# Altium schematic sheet adg731-switches.SchDoc
size A4
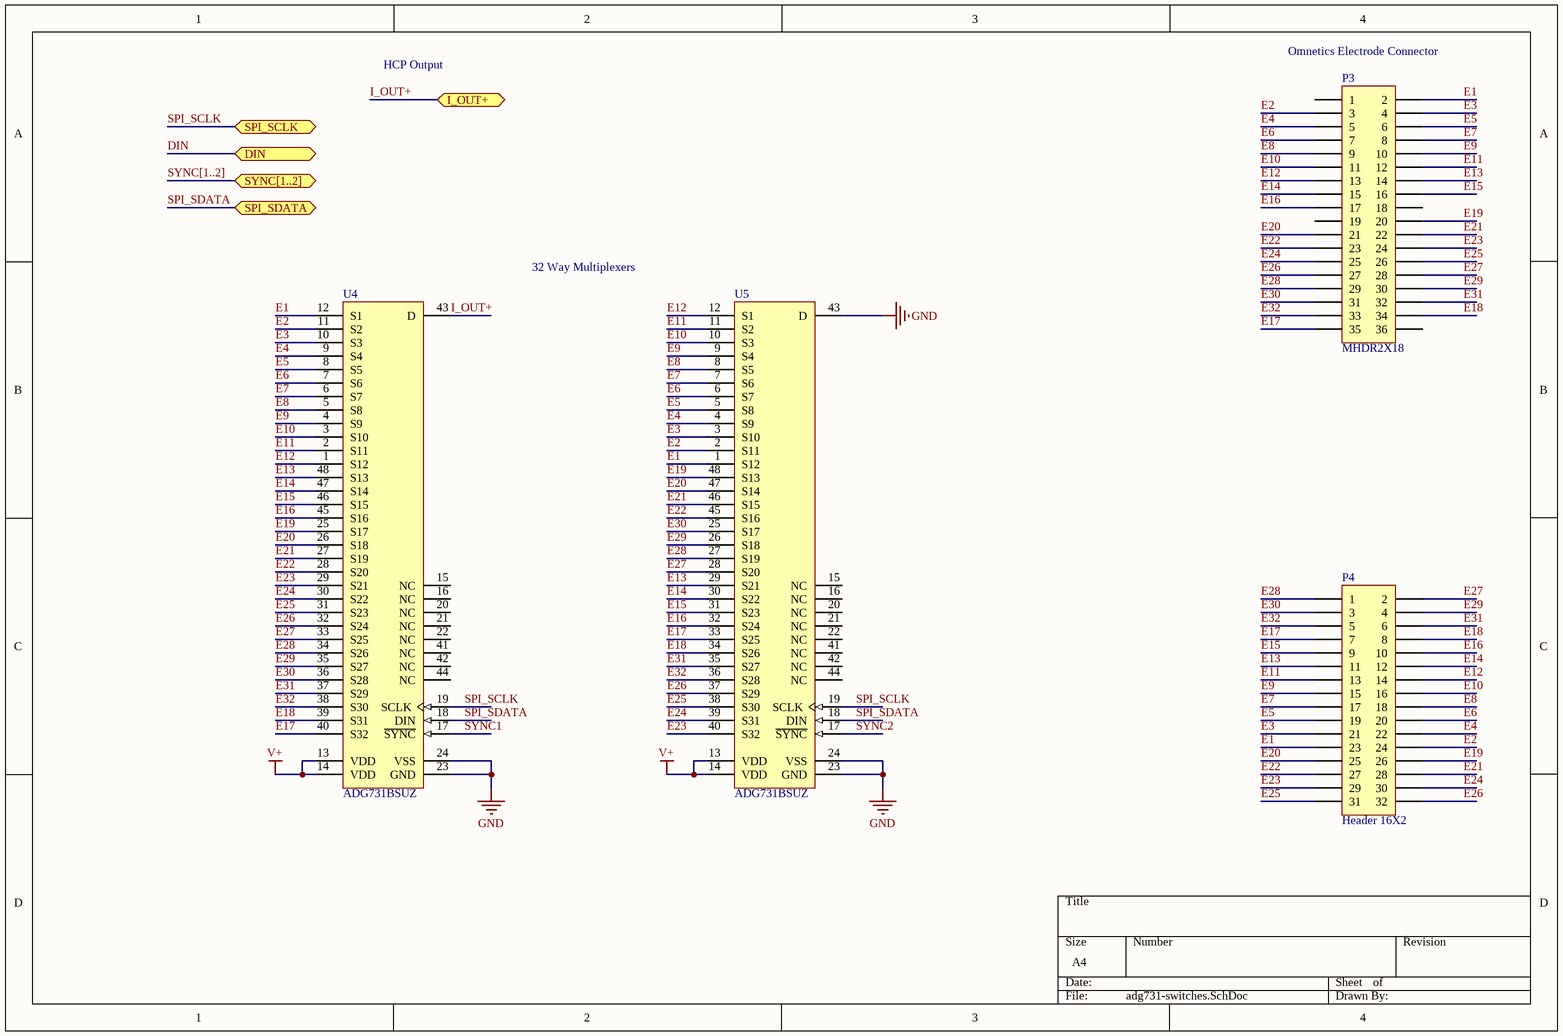
[diagram p0: adg731-switches.SchDoc]

## Parts
P3  MHDR2X18  [A79025-001]
P4  Header 16X2  [FTSH-117-XX-XXX-DH]
U4  ADG731BSUZ  [ADI-SU-48_N]
U5  ADG731BSUZ  [ADI-SU-48_N]

## Ports
DIN (bidir), I_OUT+ (bidir), SPI_SCLK (bidir), SPI_SDATA (bidir), SYNC[1..2] (bidir)

## Nets
GND: U4.23(GND) U4.24(VSS) U5.23(GND) U5.24(VSS) U5.43(D)
V+: U4.13(VDD) U4.14(VDD) U5.13(VDD) U5.14(VDD)
DIN: port DIN
E1: P3.2 P4.23 U4.12(S1) U5.1(S12)
E2: P3.3 P4.24 U4.11(S2) U5.2(S11)
E3: P3.4 P4.21 U4.10(S3) U5.3(S10)
E4: P3.5 P4.22 U4.9(S4) U5.4(S9)
E5: P3.6 P4.19 U4.8(S5) U5.5(S8)
E6: P3.7 P4.20 U4.7(S6) U5.6(S7)
E7: P3.8 P4.17 U4.6(S7) U5.7(S6)
E8: P3.9 P4.18 U4.5(S8) U5.8(S5)
E9: P3.10 P4.15 U4.4(S9) U5.9(S4)
E10: P3.11 P4.16 U4.3(S10) U5.10(S3)
E11: P3.12 P4.13 U4.2(S11) U5.11(S2)
E12: P3.13 P4.14 U4.1(S12) U5.12(S1)
E13: P3.14 P4.11 U4.48(S13) U5.29(S21)
E14: P3.15 P4.12 U4.47(S14) U5.30(S22)
E15: P3.16 P4.9 U4.46(S15) U5.31(S23)
E16: P3.17 P4.10 U4.45(S16) U5.32(S24)
E17: P3.35 P4.7 U4.40(S32) U5.33(S25)
E18: P3.34 P4.8 U4.39(S31) U5.34(S26)
E19: P3.20 P4.26 U4.25(S17) U5.48(S13)
E20: P3.21 P4.25 U4.26(S18) U5.47(S14)
E21: P3.22 P4.28 U4.27(S19) U5.46(S15)
E22: P3.23 P4.27 U4.28(S20) U5.45(S16)
E23: P3.24 P4.29 U4.29(S21) U5.40(S32)
E24: P3.25 P4.30 U4.30(S22) U5.39(S31)
E25: P3.26 P4.31 U4.31(S23) U5.38(S30)
E26: P3.27 P4.32 U4.32(S24) U5.37(S29)
E27: P3.28 P4.2 U4.33(S25) U5.28(S20)
E28: P3.29 P4.1 U4.34(S26) U5.27(S19)
E29: P3.30 P4.4 U4.35(S27) U5.26(S18)
E30: P3.31 P4.3 U4.36(S28) U5.25(S17)
E31: P3.32 P4.6 U4.37(S29) U5.35(S27)
E32: P3.33 P4.5 U4.38(S30) U5.36(S28)
I_OUT+: U4.43(D) ; port I_OUT+
SPI_SCLK: U4.19(SCLK) U5.19(SCLK) ; port SPI_SCLK
SPI_SDATA: U4.18(DIN) U5.18(DIN) ; port SPI_SDATA
SYNC1: U4.17(~{SYNC})
SYNC2: U5.17(~{SYNC})

Not connected (* = marked no-connect by the designer): P3 1 18 19 36; U4 15(NC) 16(NC) 20(NC) 21(NC) 22(NC) 41(NC) 42(NC) 44(NC); U5 15(NC) 16(NC) 20(NC) 21(NC) 22(NC) 41(NC) 42(NC) 44(NC)

## Buses and harness runs
bus SYNC[1..2] = port SYNC[1..2]

## Notes on the sheet
- HCP Output
- (near P3) Omnetics Electrode Connector
- 32 Way Multiplexers

## Library data of the parts
P3 = MHDR2X18: Header, 18-Pin, Dual row; LatestRevisionDate: 17-Jul-2002; LatestRevisionNote: Re-released for DXP Platform.; Publisher: Altium Limited
P4 = Header 16X2: Header, 16-Pin, Dual row; LatestRevisionDate: 17-Jul-2002; LatestRevisionNote: Re-released for DXP Platform.; Publisher: Altium Limited
U4 U5 = CMP-0798-00240-1: 1.8 to 5.5 V / +/-2.5 V, 4 Ohm, Serially Controlled, 32-Channel Analog Multiplexer, -40 to 85 degC, 48-pin QFP (SU-48), Tray; Manufacturer: Analog Devices; Bandwidth (Hz): 18M; Max Analog Signal Range: Vss to Vdd; t transition (s): 42n; Ron (ohms): 4; Supply V Guar Performance: Dual_(+/-2.5V), Single_(+3V), Single_(+5V); ComponentLink2Description: Datasheet; Packing: Tray; Code_JEDEC: MS-026ABC; ComponentLink3URL: http://www.analog.com/static/imported-files/packages/470644706845302410119987SU48_7x7.pdf; PackageDescription: 48-Pin Thin Plastic Quad Flat Package, Body 7 x 7 mm, Pitch 0.5 mm; ComponentLink1Description: Manufacturer URL; DatasheetVersion: Rev. A; ComponentLink1URL: http://www.analog.com/en/index.html; Mounting Technology: Surface Mount; ComponentLink2URL: http://www.analog.com/static/imported-files/data_sheets/ADG725_731.pdf; PartNumber: ADG731BSUZ; PackageReference: SU-48; ComponentLink3Description: Package Specification